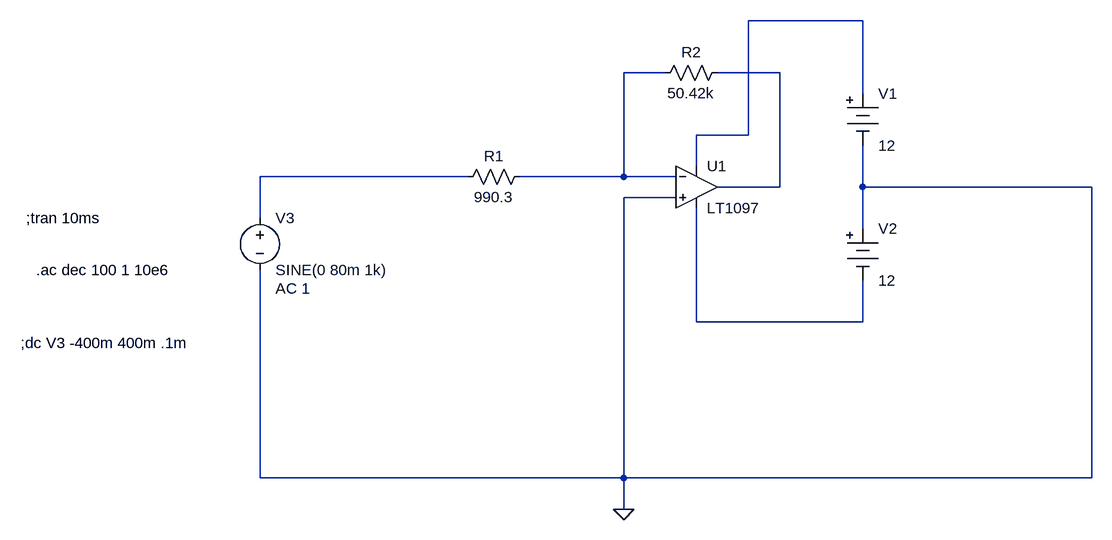
[diagram p0: schematic lab1Scheme.asc]
lab1Scheme.asc, the LTspice schematic file:
Version 4
SHEET 1 916 680
WIRE 560 -272 384 -272
WIRE 256 -192 192 -192
WIRE 432 -192 336 -192
WIRE 560 -160 560 -272
WIRE 384 -96 384 -272
WIRE 384 -96 304 -96
WIRE 304 -48 304 -96
WIRE -48 -32 -368 -32
WIRE 192 -32 192 -192
WIRE 192 -32 32 -32
WIRE 272 -32 192 -32
WIRE 432 -16 432 -192
WIRE 432 -16 336 -16
WIRE 560 -16 560 -80
WIRE 912 -16 560 -16
WIRE 272 0 192 0
WIRE -368 32 -368 -32
WIRE 560 48 560 -16
WIRE 304 192 304 16
WIRE 560 192 560 128
WIRE 560 192 304 192
WIRE -368 432 -368 112
WIRE 192 432 192 0
WIRE 192 432 -368 432
WIRE 912 432 912 -16
WIRE 912 432 192 432
WIRE 192 480 192 432
FLAG 192 480 0
SYMBOL res 48 -48 R90
WINDOW 0 0 56 VBottom 2
WINDOW 3 32 56 VTop 2
SYMATTR InstName R1
SYMATTR Value 990.3
SYMBOL res 352 -208 R90
WINDOW 0 0 56 VBottom 2
WINDOW 3 32 56 VTop 2
SYMATTR InstName R2
SYMATTR Value 50.42k
SYMBOL OpAmps\\LT1097 304 -80 R0
SYMATTR InstName U1
SYMBOL Misc\\battery 560 -176 R0
WINDOW 123 0 0 Left 0
WINDOW 39 0 0 Left 0
SYMATTR InstName V1
SYMATTR Value 12
SYMBOL Misc\\battery 560 32 R0
WINDOW 123 0 0 Left 0
WINDOW 39 0 0 Left 0
SYMATTR InstName V2
SYMATTR Value 12
SYMBOL voltage -368 16 R0
WINDOW 123 24 124 Left 2
WINDOW 39 0 0 Left 0
SYMATTR Value2 AC 1
SYMATTR InstName V3
SYMATTR Value SINE(0 80m 1k)
TEXT -736 224 Left 2 !;dc V3 -400m 400m .1m
TEXT -728 32 Left 2 !;tran 10ms
TEXT -712 112 Left 2 !.ac dec 100 1 10e6

The netlist it stands for:
* lab1Scheme.asc
R1 N002 N004 990.3
R2 N003 N002 50.42k
XU1 0 N002 N001 N005 N003 LT1097  ; pins In+ In- V+ V- OUT
V1 N001 0 12
V2 0 N005 12
V3 N004 0 SINE(0 80m 1k) AC 1
;dc V3 -400m 400m .1m
;tran 10ms
.ac dec 100 1 10e6
.backanno
.end